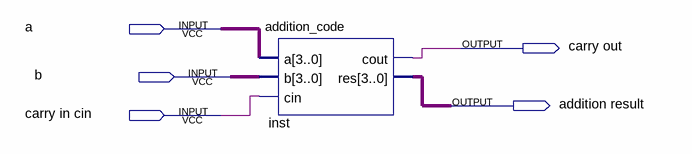
[diagram p0: schematic sheet]
// Quartus schematic addition_block.bdf as structural Verilog: 1 symbols, 5 pins
module addition_block (
  input  a,
  input  b,
  input  \carry_in_cin ,
  output \carry_out ,
  output \addition_result 
);

  wire [3:0] inst_res, undriven, undriven_2;

  addition_code inst (.a(undriven), .b(undriven_2), .cin(\carry_in_cin ), .cout(\carry_out ), .res(inst_res));
endmodule
